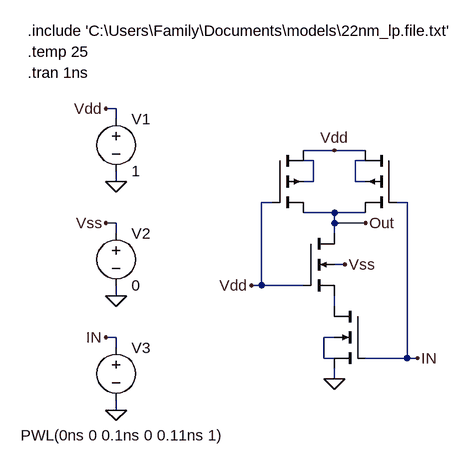
[diagram p0: schematic HW3_q1c.asc]
HW3_q1c.asc, the LTspice schematic file:
Version 4
SHEET 1 880 680
WIRE -32 -96 -48 -96
WIRE -32 -80 -32 -96
WIRE 304 -32 256 -32
WIRE 352 -32 304 -32
WIRE 272 -16 256 -16
WIRE 352 -16 336 -16
WIRE -32 16 -32 0
WIRE 272 16 272 -16
WIRE 272 16 256 16
WIRE 336 16 336 -16
WIRE 352 16 336 16
WIRE 208 48 192 48
WIRE 416 48 400 48
WIRE 304 64 256 64
WIRE 352 64 304 64
WIRE -32 80 -48 80
WIRE 304 80 304 64
WIRE 352 80 304 80
WIRE -32 96 -32 80
WIRE 304 96 304 80
WIRE 320 144 304 144
WIRE 192 176 192 48
WIRE 192 176 176 176
WIRE 256 176 192 176
WIRE -32 192 -32 176
WIRE 304 208 304 192
WIRE -32 256 -48 256
WIRE 304 256 288 256
WIRE -32 272 -32 256
WIRE 288 288 288 256
WIRE 304 288 288 288
WIRE 416 288 416 48
WIRE 416 288 352 288
WIRE 432 288 416 288
WIRE 304 320 304 304
WIRE -32 368 -32 352
FLAG 304 320 0
FLAG -48 -96 Vdd
FLAG -48 80 Vss
FLAG -48 256 IN
FLAG 432 288 IN
FLAG 176 176 Vdd
FLAG 304 -32 Vdd
FLAG 320 144 Vss
FLAG -32 16 0
FLAG -32 192 0
FLAG -32 368 0
FLAG 352 80 Out
SYMBOL nmos4 256 96 R0
WINDOW 0 56 32 Invisible 2
WINDOW 3 56 72 Invisible 2
SYMATTR InstName M1
SYMATTR Value2 l=0.03u w=0.7u
SYMBOL nmos4 352 208 M0
WINDOW 0 56 32 Invisible 2
WINDOW 3 56 72 Invisible 2
SYMATTR InstName M2
SYMATTR Value2 l=0.03u w=0.7u
SYMBOL pmos4 208 -32 R0
WINDOW 0 56 32 Invisible 2
WINDOW 3 56 72 Invisible 2
SYMATTR InstName M3
SYMATTR Value2 l=0.03u w=0.8u
SYMBOL pmos4 400 -32 M0
WINDOW 0 56 32 Invisible 2
WINDOW 3 56 72 Invisible 2
SYMATTR InstName M4
SYMATTR Value2 l=0.03u w=0.8u
SYMBOL voltage -32 -96 R0
WINDOW 123 0 0 Left 2
WINDOW 39 0 0 Left 2
SYMATTR InstName V1
SYMATTR Value 1
SYMBOL voltage -32 80 R0
WINDOW 123 0 0 Left 2
WINDOW 39 0 0 Left 2
SYMATTR InstName V2
SYMATTR Value 0
SYMBOL voltage -32 256 R0
WINDOW 3 -147 151 Left 2
WINDOW 123 0 0 Left 2
WINDOW 39 0 0 Left 2
SYMATTR Value PWL(0ns 0 0.1ns 0 0.11ns 1)
SYMATTR InstName V3
TEXT -168 -216 Left 2 !.include 'C:\\Users\\Family\\Documents\\models\\22nm_lp.file.txt'
TEXT -168 -184 Left 2 !.temp 25
TEXT -168 -152 Left 2 !.tran 1ns

The netlist it stands for:
* HW3_q1c.asc
M1 Out Vdd N003 Vss NMOS l=0.03u w=0.7u
M2 N003 IN 0 N004 NMOS l=0.03u w=0.7u
M3 Vdd Vdd Out N001 PMOS l=0.03u w=0.8u
M4 Vdd IN Out N002 PMOS l=0.03u w=0.8u
V1 Vdd 0 1
V2 Vss 0 0
V3 IN 0 PWL(0ns 0 0.1ns 0 0.11ns 1)
.model NMOS NMOS
.model PMOS PMOS
.lib standard.mos
.include 'C:\Users\Family\Documents\models\22nm_lp.file.txt'
.temp 25
.tran 1ns
.backanno
.end